# Altium schematic sheet 2_SurvBot_RCU_MCU.SchDoc
size A4; SheetNumber: 3; SheetTotal: 8
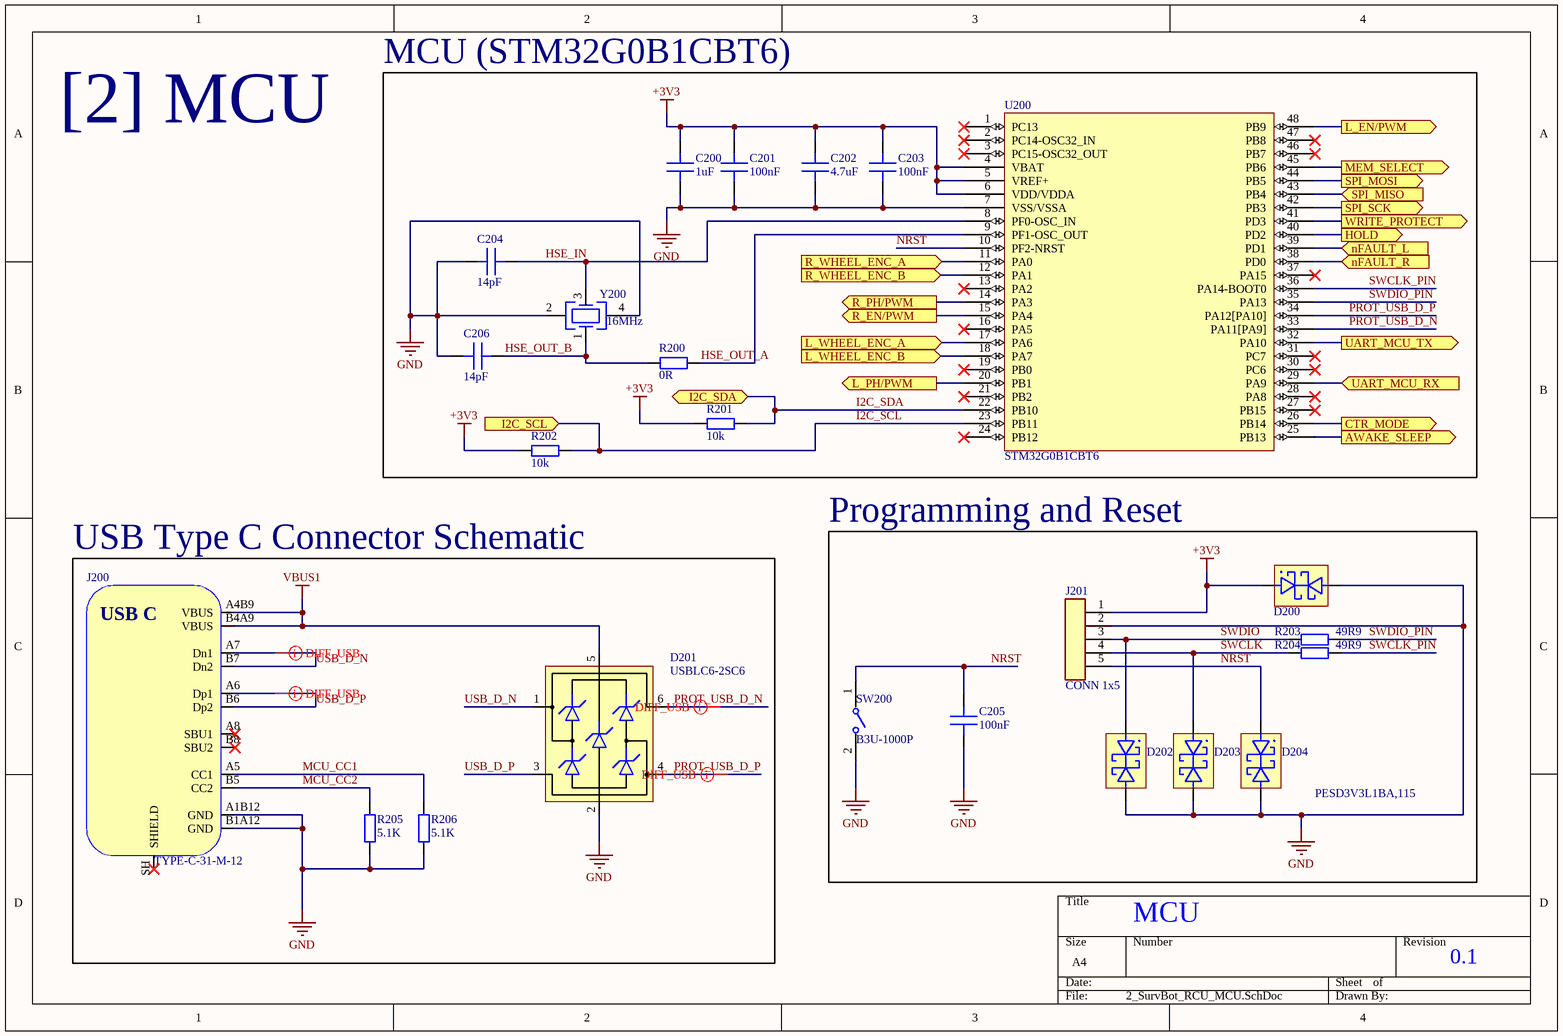
[diagram p0: 2_SurvBot_RCU_MCU.SchDoc]

## Parts
C200  1uF  [CAP_0402]
C201  100nF  [CAP_0402]
C202  4.7uF  [CAP_0402]
C203  100nF  [CAP_0402]
C204  14pF  [CAP_0402]
C205  100nF  [CAP_0402]
C206  14pF  [CAP_0402]
D200  PESD3V3L1BA,115  [SC-76, SOD-323]  (value not drawn)
D201  USBLC6-2SC6  [SOT-23-6]
D202  PESD3V3L1BA,115  [SC-76, SOD-323]  (value not drawn)
D203  PESD3V3L1BA,115  [SC-76, SOD-323]  (value not drawn)
D204  PESD3V3L1BA,115  [SC-76, SOD-323]  (value not drawn)
J200  TYPE-C-31-M-12  [USB4105-GF-A-060]
J201  CONN 1x5  [2541FV-5P]
R200  0R  [RES_0402]
R201  10k  [RES_0402]
R202  10k  [RES_0402]
R203  49R9  [RES_0603]
R204  49R9  [RES_0603]
R205  5.1K  [RES_0603]
R206  5.1K  [RES_0603]
SW200  B3U-1000P  [FP-B3U-1000P-MFG]
U200  STM32G0B1CBT6  [48-LQFP (7x7mm)]
Y200  16MHz  [SMD3225-4P]

## Blocks framed on the sheet
MCU (STM32G0B1CBT6): C200-C204 C206 R200-R202 U200 Y200
USB Type C Connector Schematic: D201 J200 R205 R206
Programming and Reset: C205 D200 D202-D204 J201 R203 R204 SW200

## Ports
AWAKE_SLEEP (out, see 0_SurvBot_RCU_Overview[3B], 3_SurvBot_RCU_MotorControl[4A], 3_SurvBot_RCU_MotorControl[4C]), CTR_MODE (out, see 0_SurvBot_RCU_Overview[3C], 3_SurvBot_RCU_MotorControl[6A], 3_SurvBot_RCU_MotorControl[6C]), HOLD (out, see 0_SurvBot_RCU_Overview[2B], 7_SurvBot_RCU_ExternalMemory[1C]), I2C_SCL (in, see 0_SurvBot_RCU_Overview[3C], 5_SurvBot_RCU_Sensors[1B], 5_SurvBot_RCU_Sensors[2D], 5_SurvBot_RCU_Sensors[3B], 6_SurvBot_RCU_CurrentFeedback[1B], 6_SurvBot_RCU_CurrentFeedback[1C]), I2C_SDA (bidir, see 0_SurvBot_RCU_Overview[2C], 5_SurvBot_RCU_Sensors[1B], 5_SurvBot_RCU_Sensors[2C], 5_SurvBot_RCU_Sensors[3B], 6_SurvBot_RCU_CurrentFeedback[1B], 6_SurvBot_RCU_CurrentFeedback[1C]), L_EN/PWM (out, see 0_SurvBot_RCU_Overview[3B], 3_SurvBot_RCU_MotorControl[4C]), L_PH/PWM (out, see 0_SurvBot_RCU_Overview[3B], 3_SurvBot_RCU_MotorControl[4C]), L_WHEEL_ENC_A (in, see 0_SurvBot_RCU_Overview[3B], 3_SurvBot_RCU_MotorControl[5D]), L_WHEEL_ENC_B (in, see 0_SurvBot_RCU_Overview[3B], 3_SurvBot_RCU_MotorControl[7D]), MEM_SELECT (out, see 0_SurvBot_RCU_Overview[2B], 7_SurvBot_RCU_ExternalMemory[1C]), nFAULT_L (in, see 0_SurvBot_RCU_Overview[3B], 3_SurvBot_RCU_MotorControl[4C]), nFAULT_R (in, see 0_SurvBot_RCU_Overview[3B], 3_SurvBot_RCU_MotorControl[4A]), R_EN/PWM (out, see 0_SurvBot_RCU_Overview[3B], 3_SurvBot_RCU_MotorControl[4A]), R_PH/PWM (out, see 0_SurvBot_RCU_Overview[3B], 3_SurvBot_RCU_MotorControl[4A]), R_WHEEL_ENC_A (in, see 0_SurvBot_RCU_Overview[3B], 3_SurvBot_RCU_MotorControl[5B]), R_WHEEL_ENC_B (in, see 0_SurvBot_RCU_Overview[3B], 3_SurvBot_RCU_MotorControl[6B]), SPI_MISO (in, see 0_SurvBot_RCU_Overview[2B], 7_SurvBot_RCU_ExternalMemory[3C]), SPI_MOSI (out, see 0_SurvBot_RCU_Overview[2B], 7_SurvBot_RCU_ExternalMemory[1C]), SPI_SCK (out, see 0_SurvBot_RCU_Overview[2B], 7_SurvBot_RCU_ExternalMemory[1C]), UART_MCU_RX (in, see 0_SurvBot_RCU_Overview[2C], 4_SurvBot_RCU_Bluetooth[1C]), UART_MCU_TX (out, see 0_SurvBot_RCU_Overview[2C], 4_SurvBot_RCU_Bluetooth[1C]), WRITE_PROTECT (out, see 0_SurvBot_RCU_Overview[2B], 7_SurvBot_RCU_ExternalMemory[1C])

## Nets
+3V3: C200.2 C201.2 C202.2 C203.2 D200.K1 J201.1 R201.1 R202.2 U200.4(VBAT) U200.5(VREF+) U200.6(VDD/VDDA)
GND: C200.1 C201.1 C202.1 C203.1 C204.1 C205.1 C206.1 D200.K2 D201.2(GND) D202.K2 D203.K2 D204.K2 J200.A1B12(GND) J200.B1A12(GND) J201.2 R205.1 R206.1 SW200.2 U200.7(VSS/VSSA) Y200.2(GND) Y200.4(GND)
VBUS1: D201.5(VBUS) J200.A4B9(VBUS) J200.B4A9(VBUS)
AWAKE_SLEEP: U200.25(PB13) ; port AWAKE_SLEEP
CTR_MODE: U200.26(PB14) ; port CTR_MODE
HOLD: U200.40(PD2) ; port HOLD
HSE_IN: C204.2 U200.8(PF0-OSC_IN) Y200.3(OSC)
HSE_OUT_A: R200.2 U200.9(PF1-OSC_OUT)
HSE_OUT_B: C206.2 R200.1 Y200.1(OSC)
I2C_SCL: R202.1 U200.23(PB11) ; port I2C_SCL
I2C_SDA: R201.2 U200.22(PB10) ; port I2C_SDA
L_EN/PWM: U200.48(PB9) ; port L_EN/PWM
L_PH/PWM: U200.20(PB1) ; port L_PH/PWM
L_WHEEL_ENC_A: U200.17(PA6) ; port L_WHEEL_ENC_A
L_WHEEL_ENC_B: U200.18(PA7) ; port L_WHEEL_ENC_B
MCU_CC1: J200.A5(CC1) R206.2
MCU_CC2: J200.B5(CC2) R205.2
MEM_SELECT: U200.45(PB6) ; port MEM_SELECT
nFAULT_L: U200.39(PD1) ; port nFAULT_L
nFAULT_R: U200.38(PD0) ; port nFAULT_R
NRST: C205.2 D204.K1 J201.5 SW200.1 U200.10(PF2-NRST)
PROT_USB_D_N: D201.6(IO1) U200.33(PA11[PA9])
PROT_USB_D_P: D201.4(IO2) U200.34(PA12[PA10])
R_EN/PWM: U200.15(PA4) ; port R_EN/PWM
R_PH/PWM: U200.14(PA3) ; port R_PH/PWM
R_WHEEL_ENC_A: U200.11(PA0) ; port R_WHEEL_ENC_A
R_WHEEL_ENC_B: U200.12(PA1) ; port R_WHEEL_ENC_B
SPI_MISO: U200.43(PB4) ; port SPI_MISO
SPI_MOSI: U200.44(PB5) ; port SPI_MOSI
SPI_SCK: U200.42(PB3) ; port SPI_SCK
SWCLK: D203.K1 J201.4 R204.1
SWCLK_PIN: R204.2 U200.36(PA14-BOOT0)
SWDIO: D202.K1 J201.3 R203.1
SWDIO_PIN: R203.2 U200.35(PA13)
UART_MCU_RX: U200.29(PA9) ; port UART_MCU_RX
UART_MCU_TX: U200.32(PA10) ; port UART_MCU_TX
USB_D_N: D201.1(IO1) J200.A7(Dn1) J200.B7(Dn2)
USB_D_P: D201.3(IO2) J200.A6(Dp1) J200.B6(Dp2)
WRITE_PROTECT: U200.41(PD3) ; port WRITE_PROTECT

Not connected (* = marked no-connect by the designer): J200 A8(SBU1)* B8(SBU2)* SH(SHIELD)*; U200 1(PC13)* 2(PC14-OSC32_IN)* 3(PC15-OSC32_OUT)* 13(PA2)* 16(PA5)* 19(PB0)* 21(PB2)* 24(PB12)* 27(PB15)* 28(PA8)* 30(PC6)* 31(PC7)* 37(PA15)* 46(PB7)* 47(PB8)*

## Layout directives
differential pair; differential pair class USB: PROT_USB_D_N, PROT_USB_D_P, USB_D_N, USB_D_P

## Notes on the sheet
- [2] MCU
- PESD3V3L1BA,115
- MCU
- 0.1
- (in symbol USB4105-GF-A-060_1) USB C

## Library data of the parts
C200 = CAP_1uF-16V-10%-0402: 1 µF ±10% 16V Ceramic Capacitor X5R 0402 (1005 Metric); Manufacturer: Samsung Electro-Mechanics; Manufacturer Part #: CL05A105KO5NNNC; Case/Package: 0402; Supplier: JLCPCB; Supplier Part #: C29266
C201 C203 C205 = CAP_100nF-10V-10%-0402: 0.1 µF ±10% 10V Ceramic Capacitor X7R 0402 (1005 Metric); Manufacturer: Samsung Electro-Mechanics; Manufacturer Part #: CL05B104KP5NNNC; Case/Package: 0402; Supplier: JLCPCB; Supplier Part #: C133086
C202 = CAP_4.7uF-10V-20%-0402: 4.7 µF ±20% 10V Ceramic Capacitor X5R 0402 (1005 Metric); Manufacturer: Samsung Electro-Mechanics; Manufacturer Part #: CL05A475MP5NRNC; Case/Package: 0402; Supplier: JLCPCB; Supplier Part #: Supplier Part #
C204 C206 = CAP_14pF-50V-5%-0402: 50V 14pF NP0 ±5% 0402 Multilayer Ceramic Capacitors MLCC - SMD/SMT ROHS; Manufacturer: Walsin Tech Corp; Manufacturer Part #: 0402N140J500CT; Case/Package: 0402; Supplier: JLCPCB; Supplier Part #: C458857
D200 D202-D204 = DIO-TVS_3.3V-26V-18A-SOD-323: 26V Clamp 18A (8/20µs) Ipp Tvs Diode Surface Mount SOD-323; Manufacturer: Nexperia; Manufacturer Part #: PESD3V3L1BA,115; Case/Package: SOD-323; Supplier: JLCPCB; Supplier Part #: C51450
D201 = USBLC6-2SC6: Low-Capacitance ESD Protection USB; Manufacturer: STMicroelectronics; Manufacturer Part Number: USBLC6-2SC6; Distributor Link: https://www.mouser.de/ProductDetail/STMicroelectronics/USBLC6-2SC6?qs=po45yt2pPpu%2FhNIlwQdTlg%3D%3D
J200 = USB4105-GF-A-060_1: 5A 1 16P Female Type-C SMD USB Connectors ROHS; Manufacturer: Korean Hroparts Elec; Manufacturer Part Number: TYPE-C-31-M-12; Package: SMD; Supplier: JLCPCB; Supplier Part #: C165948
J201 = CONN_5_HDR_0.1-2541FV-5P: 2.54mm 3A Single Row -40℃~+105℃ 250V 5P Direct Insert 1x5P Top Square Hole Plugin,P=2.54mm Female Headers ROHS; Manufacturer: HanElectricity; Manufacturer Part #: 2541FV-5P; Case/Package: P=2.54mm; Supplier: JLCPCB; Supplier Part #: C18723050
R200 = RES_0R-62.5mW-5%-0402: 0 Ohms Jumper Chip Resistor 0402 (1005 Metric) Moisture Resistant Thick Film; Manufacturer: YAGEO; Manufacturer Part #: RC0402JR-070RL; Case/Package: 0402; Supplier: JLCPCB; Supplier Part #: C60485
R201 R202 = RES_10K-62.5mW-1%-0402: 10 kOhms ±1% 0.063W, 1/16W Chip Resistor 0402 (1005 Metric) Moisture Resistant Thick Film; Manufacturer: YAGEO; Manufacturer Part #: RC0402FR-0710KL; Case/Package: 0402; Supplier: JLCPCB; Supplier Part #: C60490
R203 R204 = RES_49.R9-100mW-1%-0603: 49.9 Ohms ±1% 0.1W, 1/10W Chip Resistor 0603 (1608 Metric) Automotive AEC-Q200 Thick Film; Manufacturer: PANASONIC; Manufacturer Part #: ERJ3EKF49R9V; Case/Package: 0603; Supplier: JLCPCB; Supplier Part #: C403255
R205 R206 = RES_5.1K-100mW-1%-0603: 5.1 kOhms ±1% 0.1W, 1/10W Chip Resistor 0603 (1608 Metric) Moisture Resistant Thick Film; Manufacturer: YAGEO; Manufacturer Part #: RC0603FR-075K1L; Case/Package: 0603; Supplier: JLCPCB; Supplier Part #: C105580
SW200 = CMP-2100-03586-2: SWITCH TACTILE SPST-NO 0.05A 12V; Manufacturer: Omron Electronics; Contact Resistance: 100mR; Operating Force: 1.5N; Max Current Rating: 50mA; Switch Travel: 0.15mm; Actuator Type: Standard; Mechanical Life: 200000Cycles; Ratings: Dust Proof; Illumination Type: Non-Illuminated; Throw Configuration: SPST; Actuator Length: 0.4mm; Switch Function: Off-Mom; Height: 1.2mm; Width: 3mm; Weight: 0.000776oz; Contact Material: Silver; Max Voltage Rating (DC): 12V; Insulation Resistance: 100MR; Lead Free: Lead Free; Current Rating: 50mA; Termination: SMD/SMT; Length: 4mm; Voltage Rating (DC): 12V; Contact Current Rating: 50mA; Orientation: Straight; Depth: 2.5mm; Max Operating Temperature: 70°C; Packaging: Tape and Reel; Min Operating Temperature: -25°C; Package Quantity: 1; Mount: Surface Mount; Electrical Life: 200000Cycles; Manufacturer Part #: B3U-1000P; Case/Package: SMD, 2.5x3mm; Supplier: JLCPCB; Supplier Part #: C231329
U200 = STM32G0B1CBT6: ARM® Cortex®-M0+ STM32G0 Microcontroller IC 32-Bit Single-Core 64MHz 128KB (128K x 8) FLASH 48-LQFP (7x7); Manufacturer: STMicroelectronics; Manufacturer Part #: STM32G0B1CBT6; Case/Package: 48-LQFP (7x7); Supplier: JLCPCB; Supplier Part #: C2847904
Y200 = XTAL_16MHz_SMD3225-4P: 16MHz SMD crystal oscillator 12pF ±10ppm ±30ppm SMD3225-4P Crystals ROHS; Manufacturer: SJK(SHENZHEN CRYSTAL TECH); Manufacturer Part #: 7U16000E12UCG; Case/Package: SMD3225-4P; Supplier: JLCPCB; Supplier Part #: C251610